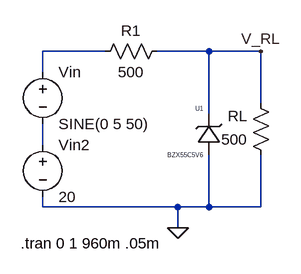
[diagram p0: schematic Draft8.asc]
Draft8.asc, the LTspice schematic file:
Version 4
SHEET 1 880 680
WIRE 176 80 80 80
WIRE 336 80 256 80
WIRE 416 80 336 80
WIRE 80 112 80 80
WIRE 416 160 416 80
WIRE 336 176 336 80
WIRE 80 224 80 192
WIRE 80 320 80 304
WIRE 288 320 80 320
WIRE 336 320 336 240
WIRE 336 320 288 320
WIRE 416 320 416 240
WIRE 416 320 336 320
WIRE 288 352 288 320
FLAG 288 352 0
FLAG 416 80 V_RL
SYMBOL voltage 80 96 R0
WINDOW 123 0 0 Left 0
WINDOW 39 0 0 Left 0
SYMATTR InstName Vin
SYMATTR Value SINE(0 5 50)
SYMBOL voltage 80 208 R0
WINDOW 123 0 0 Left 0
WINDOW 39 0 0 Left 0
SYMATTR InstName Vin2
SYMATTR Value 20
SYMBOL res 272 64 R90
WINDOW 0 0 56 VBottom 2
WINDOW 3 32 56 VTop 2
SYMATTR InstName R1
SYMATTR Value 500
SYMBOL res 432 256 R180
WINDOW 0 36 76 Left 2
WINDOW 3 36 40 Left 2
SYMATTR InstName RL
SYMATTR Value 500
SYMBOL advee_components\\BZX55C5V6 352 240 R180
WINDOW 0 24 72 Left 0
WINDOW 3 24 0 Left 0
SYMATTR InstName U1
TEXT 46 376 Left 2 !.tran 0 1 960m .05m

The netlist it stands for:
* Draft8.asc
Vin N001 N002 SINE(0 5 50)
Vin2 N002 0 20
R1 V_RL N001 500
RL 0 V_RL 500
XU1 0 V_RL BZX55C5V6  ; pins + -
.tran 0 1 960m .05m
.lib AdvEE_Components.lib
.backanno
.end